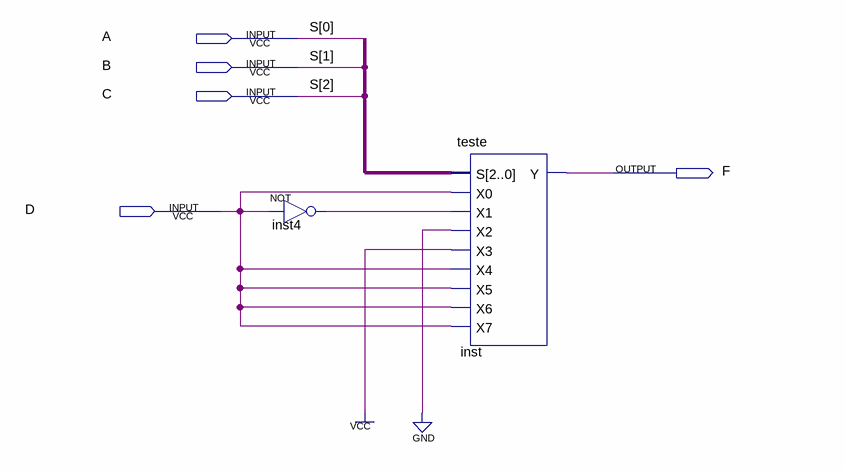
[diagram p0: schematic sheet]
// Quartus schematic Block1.bdf as structural Verilog: 2 symbols, 5 pins
module Block1 (
  input  A,
  input  B,
  input  C,
  input  D,
  output F
);

  wire inst4_out;
  wire [2:0] undriven;

  not inst4 (inst4_out, D);
  teste inst (.S(undriven), .X0(D), .X1(inst4_out), .X2(1'b0), .X3(1'b1), .X4(D), .X5(D), .X6(D), .X7(D), .Y(F));

  // Other names for the same wires on the sheet: S[2:0] = {C, B, A}
endmodule
